# Altium schematic sheet IC.SchDoc
size A4
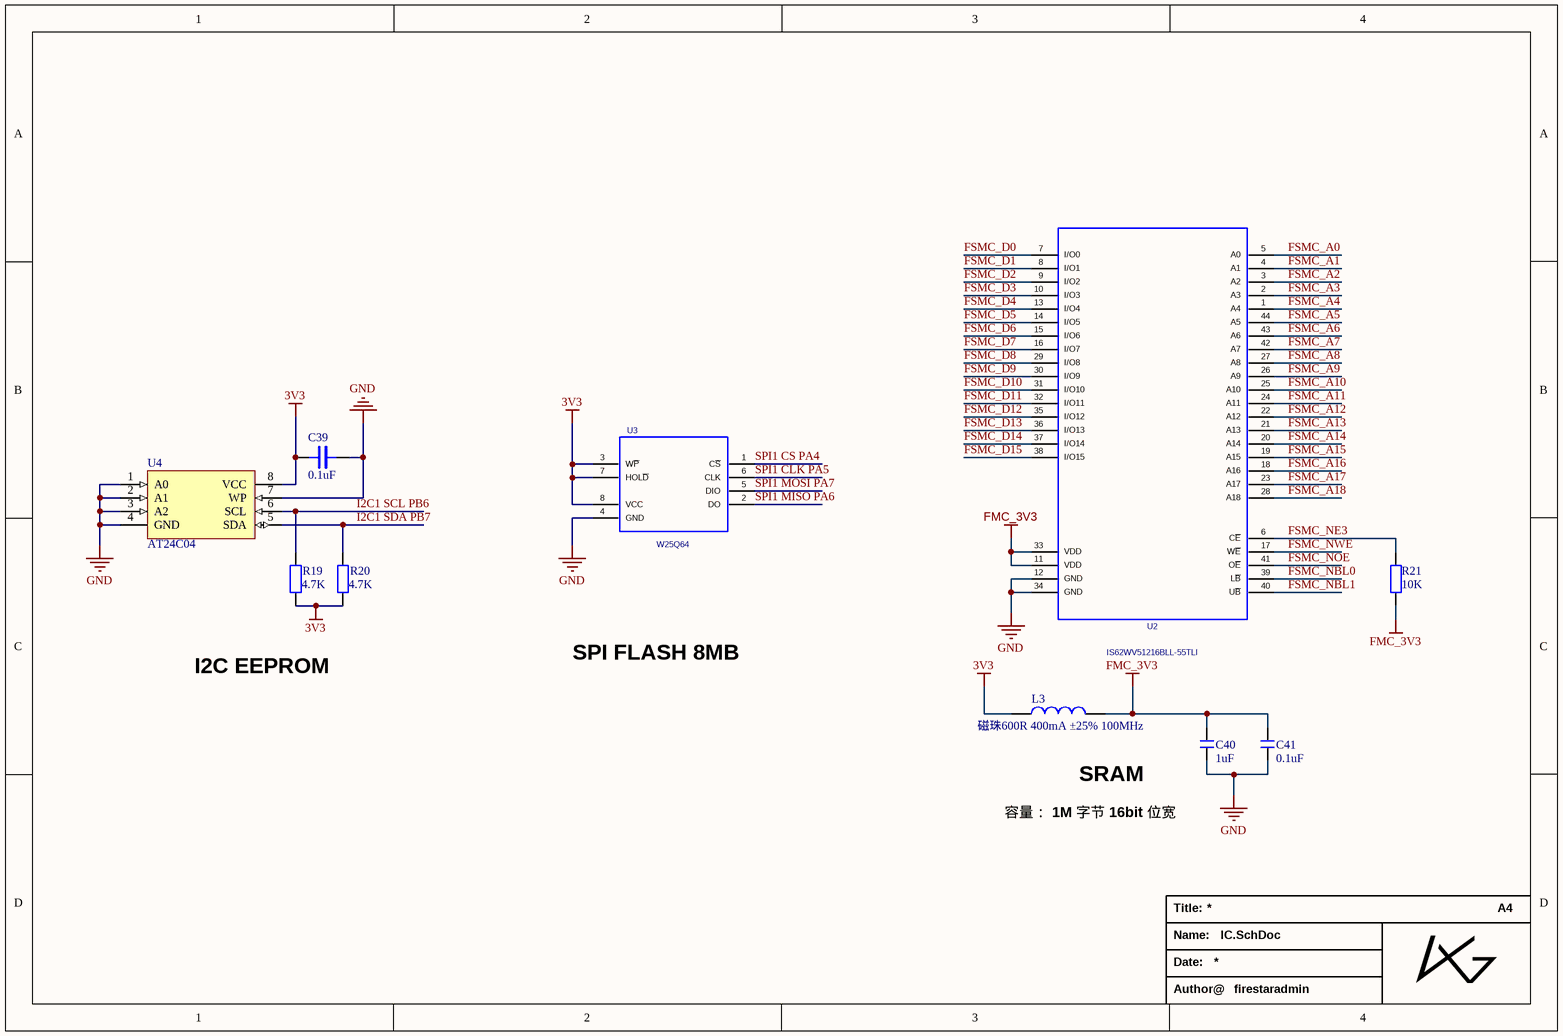
[diagram p0: IC.SchDoc]

## Parts
C39  0.1uF  [C 0603_M]
C40  1uF  [C 0603_M]
C41  0.1uF  [C 0603_M]
L3  磁珠600R 400mA ±25% 100MHz  [L 0603]
R19  4.7K  [R 0603_M]
R20  4.7K  [R 0603_M]
R21  10K  [R 0603_M]
U2  IS62WV51216BLL-55TLI  [TSOP44-0.8MM]
U3  W25Q64  [SOP8W_M]
U4  AT24C04  [SOP8_M]

## Nets
3V3: C39.1 L3.1 R19.2 R20.2 U3.3(W~{P}) U3.7(HOL~{D}) U3.8(VCC) U4.8(VCC)
FMC_3V3: C40.2 C41.2 L3.2 R21.2 U2.11(VDD) U2.33(VDD)
GND: C39.2 C40.1 C41.1 U2.12(GND) U2.34(GND) U3.4(GND) U4.1(A0) U4.2(A1) U4.3(A2) U4.4(GND) U4.7(WP)
FSMC_A0: U2.5(A0)
FSMC_A1: U2.4(A1)
FSMC_A2: U2.3(A2)
FSMC_A3: U2.2(A3)
FSMC_A4: U2.1(A4)
FSMC_A5: U2.44(A5)
FSMC_A6: U2.43(A6)
FSMC_A7: U2.42(A7)
FSMC_A8: U2.27(A8)
FSMC_A9: U2.26(A9)
FSMC_A10: U2.25(A10)
FSMC_A11: U2.24(A11)
FSMC_A12: U2.22(A12)
FSMC_A13: U2.21(A13)
FSMC_A14: U2.20(A14)
FSMC_A15: U2.19(A15)
FSMC_A16: U2.18(A16)
FSMC_A17: U2.23(A17)
FSMC_A18: U2.28(A18)
FSMC_D0: U2.7(I/O0)
FSMC_D1: U2.8(I/O1)
FSMC_D2: U2.9(I/O2)
FSMC_D3: U2.10(I/O3)
FSMC_D4: U2.13(I/O4)
FSMC_D5: U2.14(I/O5)
FSMC_D6: U2.15(I/O6)
FSMC_D7: U2.16(I/O7)
FSMC_D8: U2.29(I/O8)
FSMC_D9: U2.30(I/O9)
FSMC_D10: U2.31(I/O10)
FSMC_D11: U2.32(I/O11)
FSMC_D12: U2.35(I/O12)
FSMC_D13: U2.36(I/O13)
FSMC_D14: U2.37(I/O14)
FSMC_D15: U2.38(I/O15)
FSMC_NBL0: U2.39(L~{B})
FSMC_NBL1: U2.40(U~{B})
FSMC_NE3: R21.1 U2.6(C~{E})
FSMC_NOE: U2.41(O~{E})
FSMC_NWE: U2.17(W~{E})
I2C1 SCL PB6: R19.1 U4.6(SCL)
I2C1 SDA PB7: R20.1 U4.5(SDA)
SPI1 CLK PA5: U3.6(CLK)
SPI1 CS PA4: U3.1(C~{S})
SPI1 MISO PA6: U3.2(DO)
SPI1 MOSI PA7: U3.5(DIO)

## Notes on the sheet
- I2C EEPROM
- SPI FLASH 8MB
- (near L3) SRAM
- 容量： 1M 字节 16bit 位宽
- Title:
- A4
- Name:
- Date:
- Author@
- firestaradmin

## Library data of the parts
C39 = CAP: Capacitor
C40 C41 = C: 无极性贴片电容; 版权归属: 源创客; BOM名称: 无极性贴片电容; 学习资源: www.ooocke.com
L3 = L: 小功率贴片电感; 版权归属: 源创客; BOM名称: 小功率贴片电感; 学习资源: www.ooocke.com
R19-R21 = RES: Resistor
U2 = IS62WV51216BLL-55TLI: TSOP-II,2.5V - 3.6V, 512K x 16,55ns; Manufacturer #1 PN: IS62WV51216BLL-55TI; Manufacturer #1: ISSI; Value: IS62WV51216BLL-55TI; Tolerance: 55ns; PCB DECAL: TSOP44-0.8MM
U3 = W25Q64: PCB DECAL: SO8WB
U4 = AT24Cxx: EEPROM